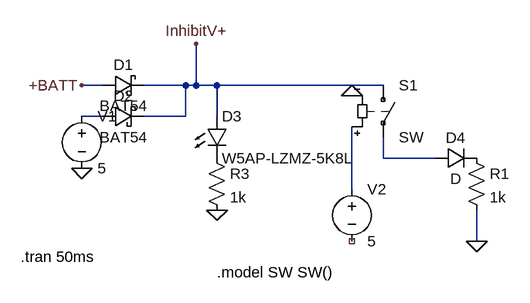
[diagram p0: schematic RBF_logic_Batt_Board.asc]
RBF_logic_Batt_Board.asc, the LTspice schematic file:
Version 4
SHEET 1 880 680
WIRE -64 16 -96 16
WIRE 64 16 0 16
WIRE 80 16 80 -48
WIRE 80 16 64 16
WIRE 112 16 80 16
WIRE 368 16 112 16
WIRE -64 64 -96 64
WIRE 64 64 64 16
WIRE 64 64 0 64
WIRE 112 64 112 16
WIRE 368 128 368 96
WIRE 448 128 368 128
WIRE 320 176 320 80
WIRE 512 256 512 208
FLAG -96 16 +BATT
FLAG -96 144 0
FLAG 112 208 0
FLAG 80 -48 InhibitV+
FLAG 512 256 0
FLAG 320 32 0
SYMBOL schottky -64 32 R270
WINDOW 0 32 32 VTop 2
WINDOW 3 0 32 VBottom 2
SYMATTR InstName D1
SYMATTR Value BAT54
SYMATTR Description Diode
SYMATTR Type diode
SYMBOL schottky -64 80 R270
WINDOW 0 32 32 VTop 2
WINDOW 3 0 32 VBottom 2
SYMATTR InstName D2
SYMATTR Value BAT54
SYMATTR Description Diode
SYMATTR Type diode
SYMBOL voltage -96 48 R0
WINDOW 123 0 0 Left 0
WINDOW 39 0 0 Left 0
SYMATTR InstName V1
SYMATTR Value 5
SYMBOL LED 96 64 R0
SYMATTR InstName D3
SYMATTR Value W5AP-LZMZ-5K8L
SYMATTR Description Diode
SYMATTR Type diode
SYMBOL res 96 112 R0
SYMATTR InstName R3
SYMATTR Value 1k
SYMBOL sw 368 0 R0
SYMATTR InstName S1
SYMBOL diode 448 144 R270
WINDOW 0 32 32 VTop 2
WINDOW 3 0 32 VBottom 2
SYMATTR InstName D4
SYMBOL res 496 112 R0
SYMATTR InstName R1
SYMATTR Value 1k
SYMBOL voltage 320 160 R0
WINDOW 123 0 0 Left 0
WINDOW 39 0 0 Left 0
SYMATTR InstName V2
SYMATTR Value 5
TEXT -190 280 Left 2 !.tran 50ms
TEXT 112 304 Left 2 !.model SW SW()

The netlist it stands for:
* RBF_logic_Batt_Board.asc
D1 +BATT InhibitV+ BAT54
D2 N001 InhibitV+ BAT54
V1 N001 0 5
D3 InhibitV+ P001 W5AP-LZMZ-5K8L
R3 P001 0 1k
S1 InhibitV+ N002 N003 0 SW
D4 N002 P002 D
R1 P002 0 1k
V2 N003 NC_01 5
.model D D
.lib standard.dio
.tran 50ms
.model SW SW()
.backanno
.end